# EasyEDA schematic 1-Schematic_testflight2 pcb.json

## Sheets
1 Sheet_1: TITLE: Sheet_1; REV: 1.0; Date: 2022-05-10; Sheet: 1/1; Drawn By: MuchiriIan; Company: Your Company
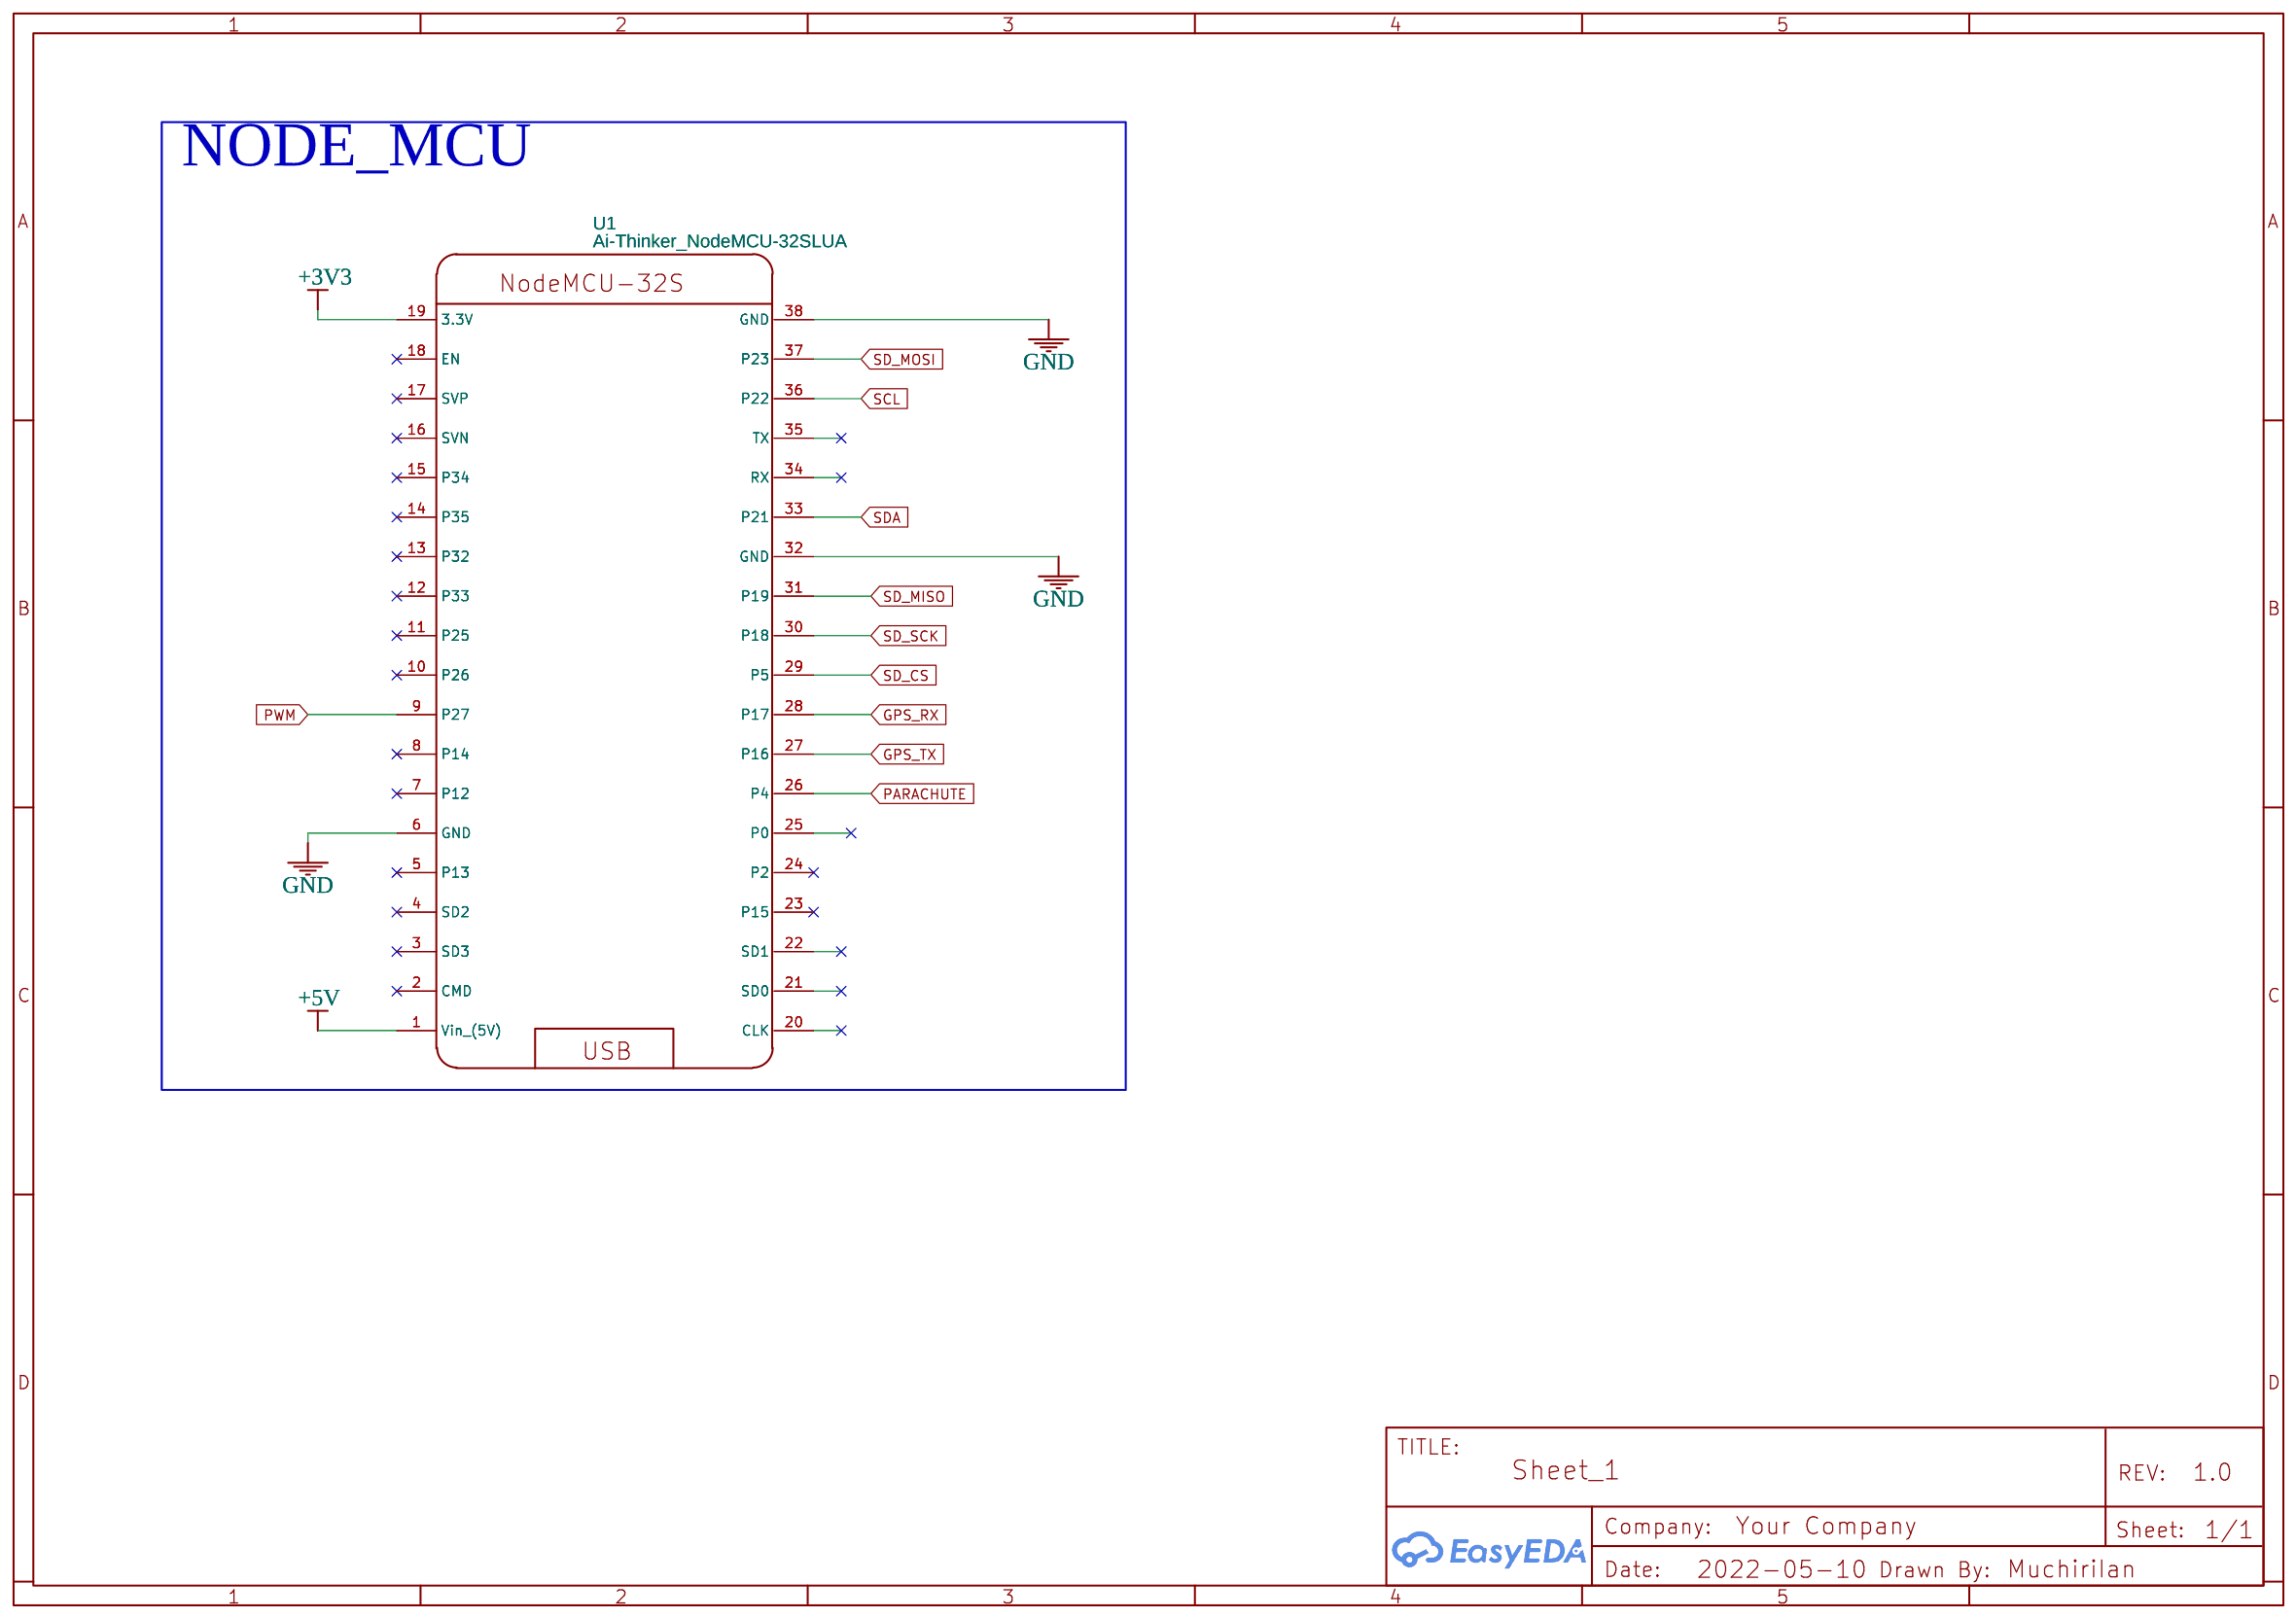
[diagram p0: Sheet_1]
2 Sheet_2: TITLE: Sheet_2
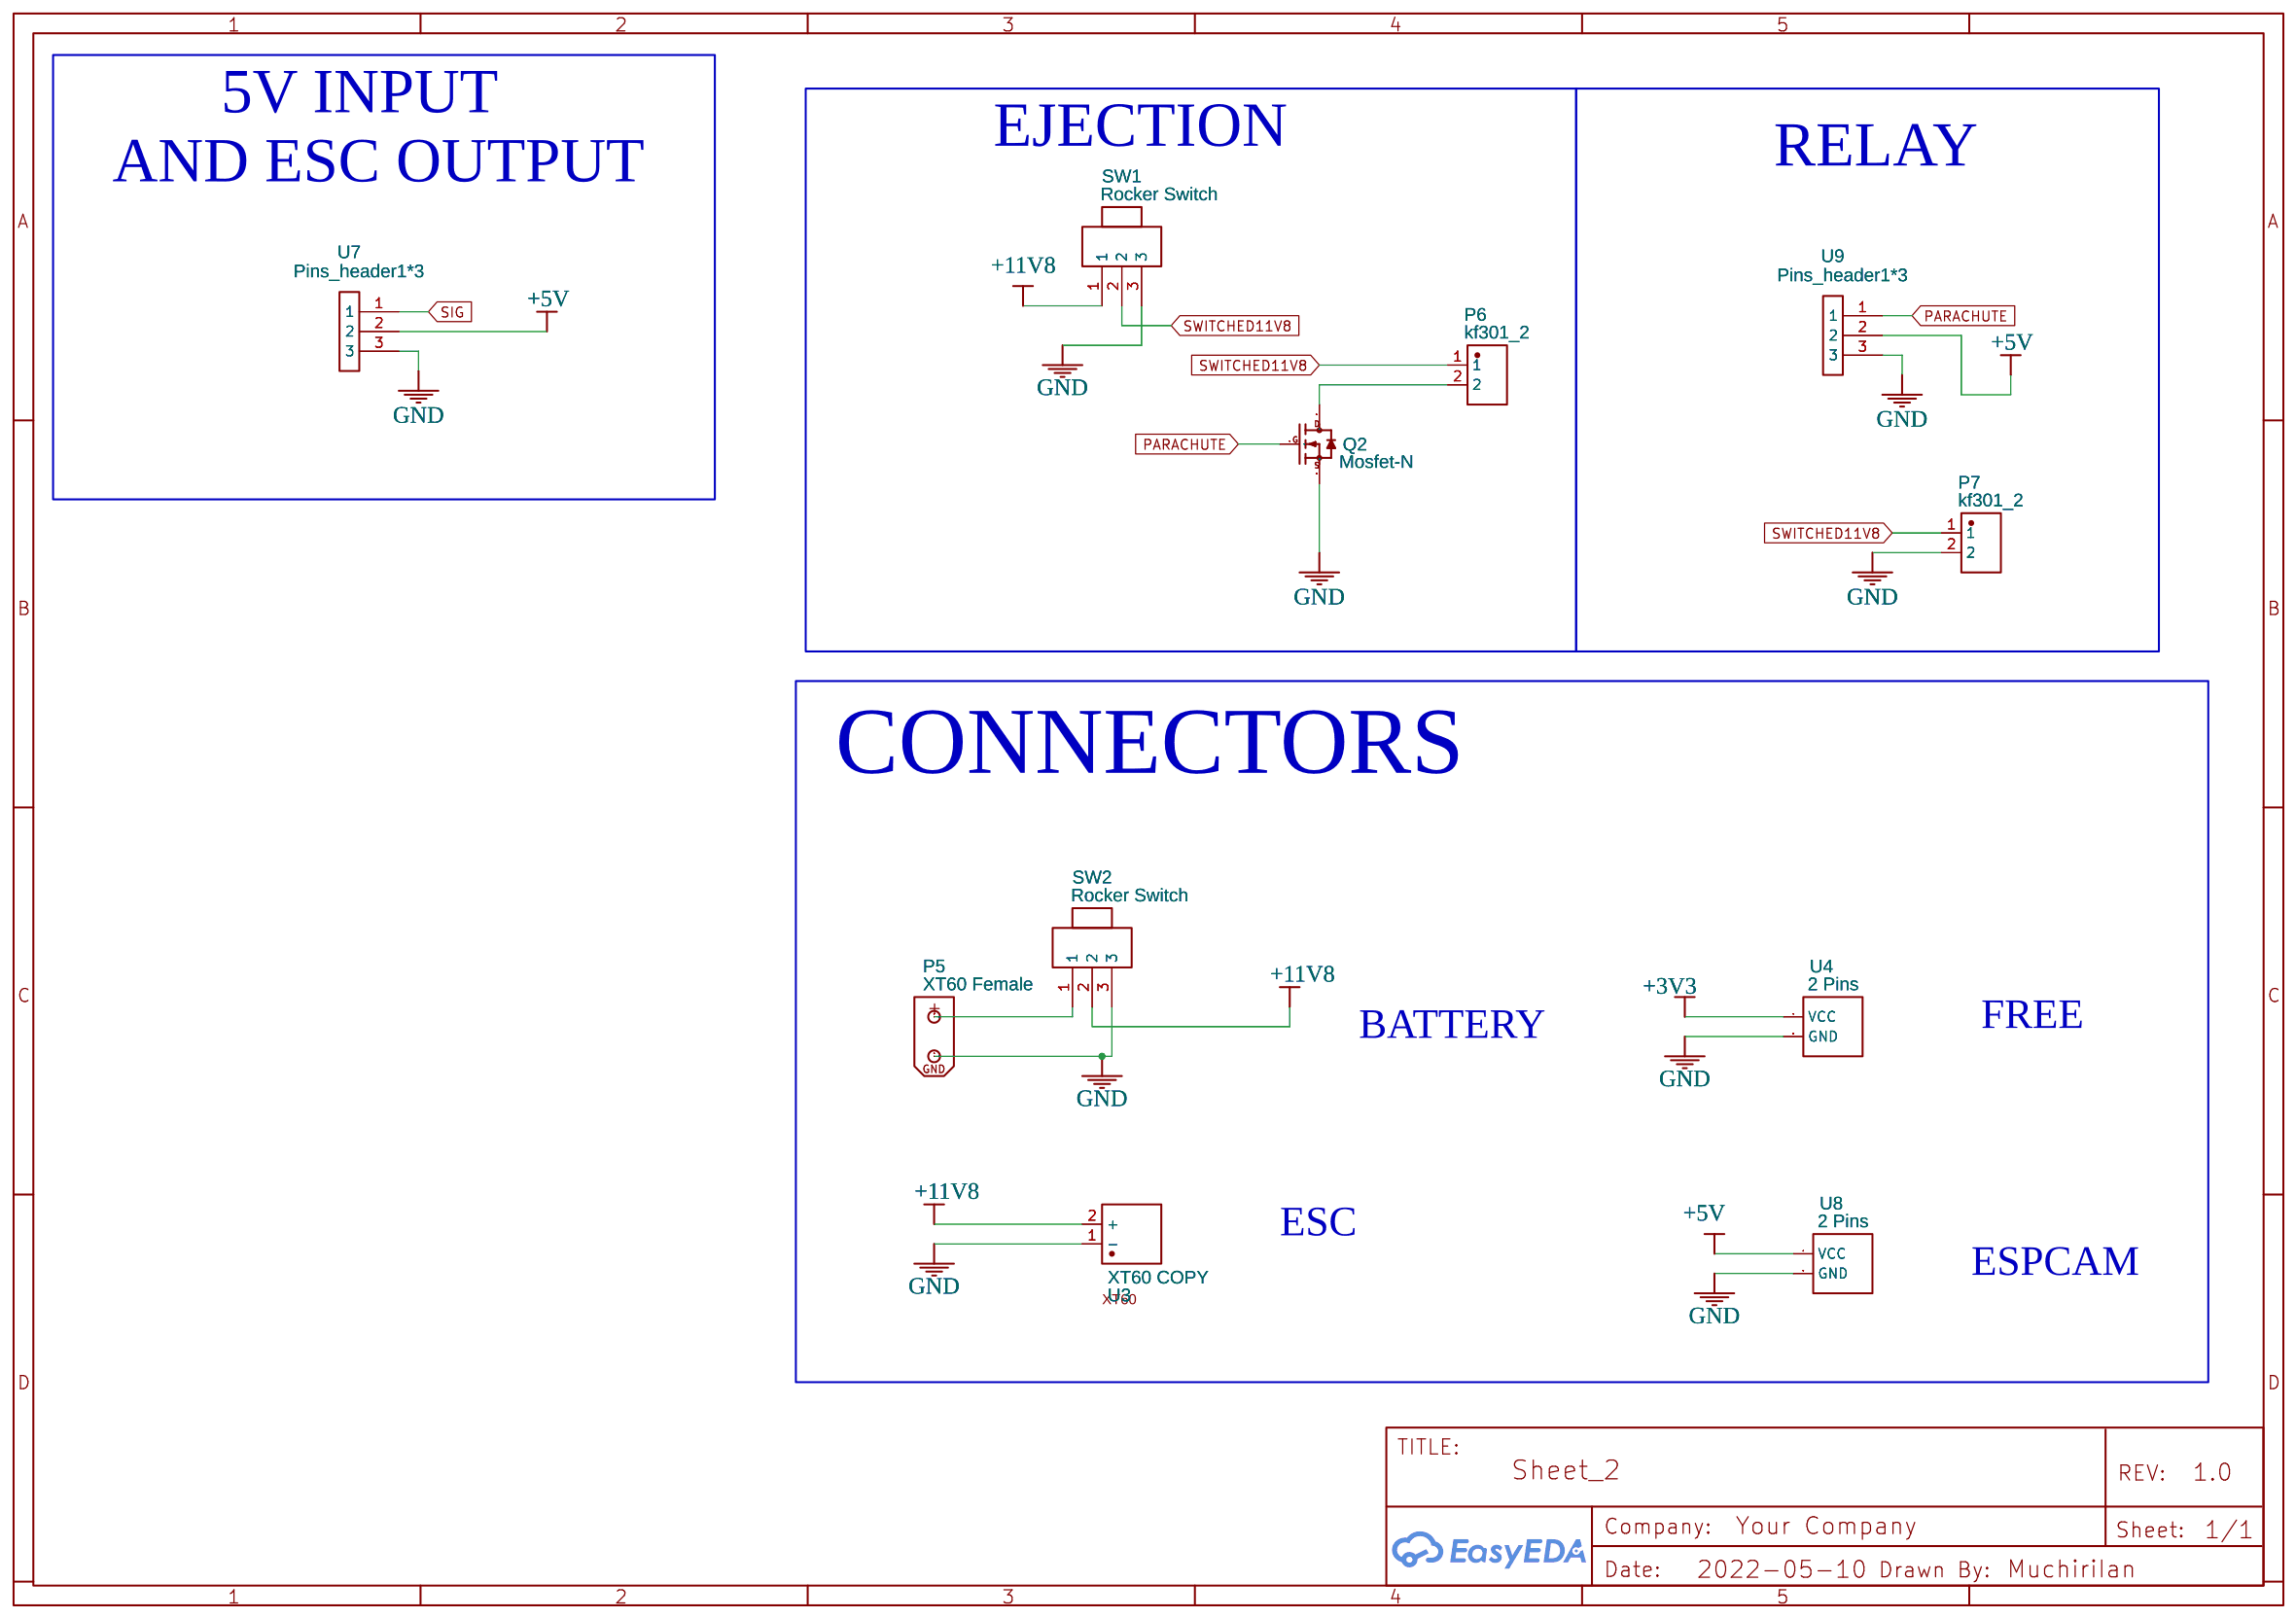
[diagram p1: Sheet_2]
3 Sheet_3: TITLE: Sheet_3
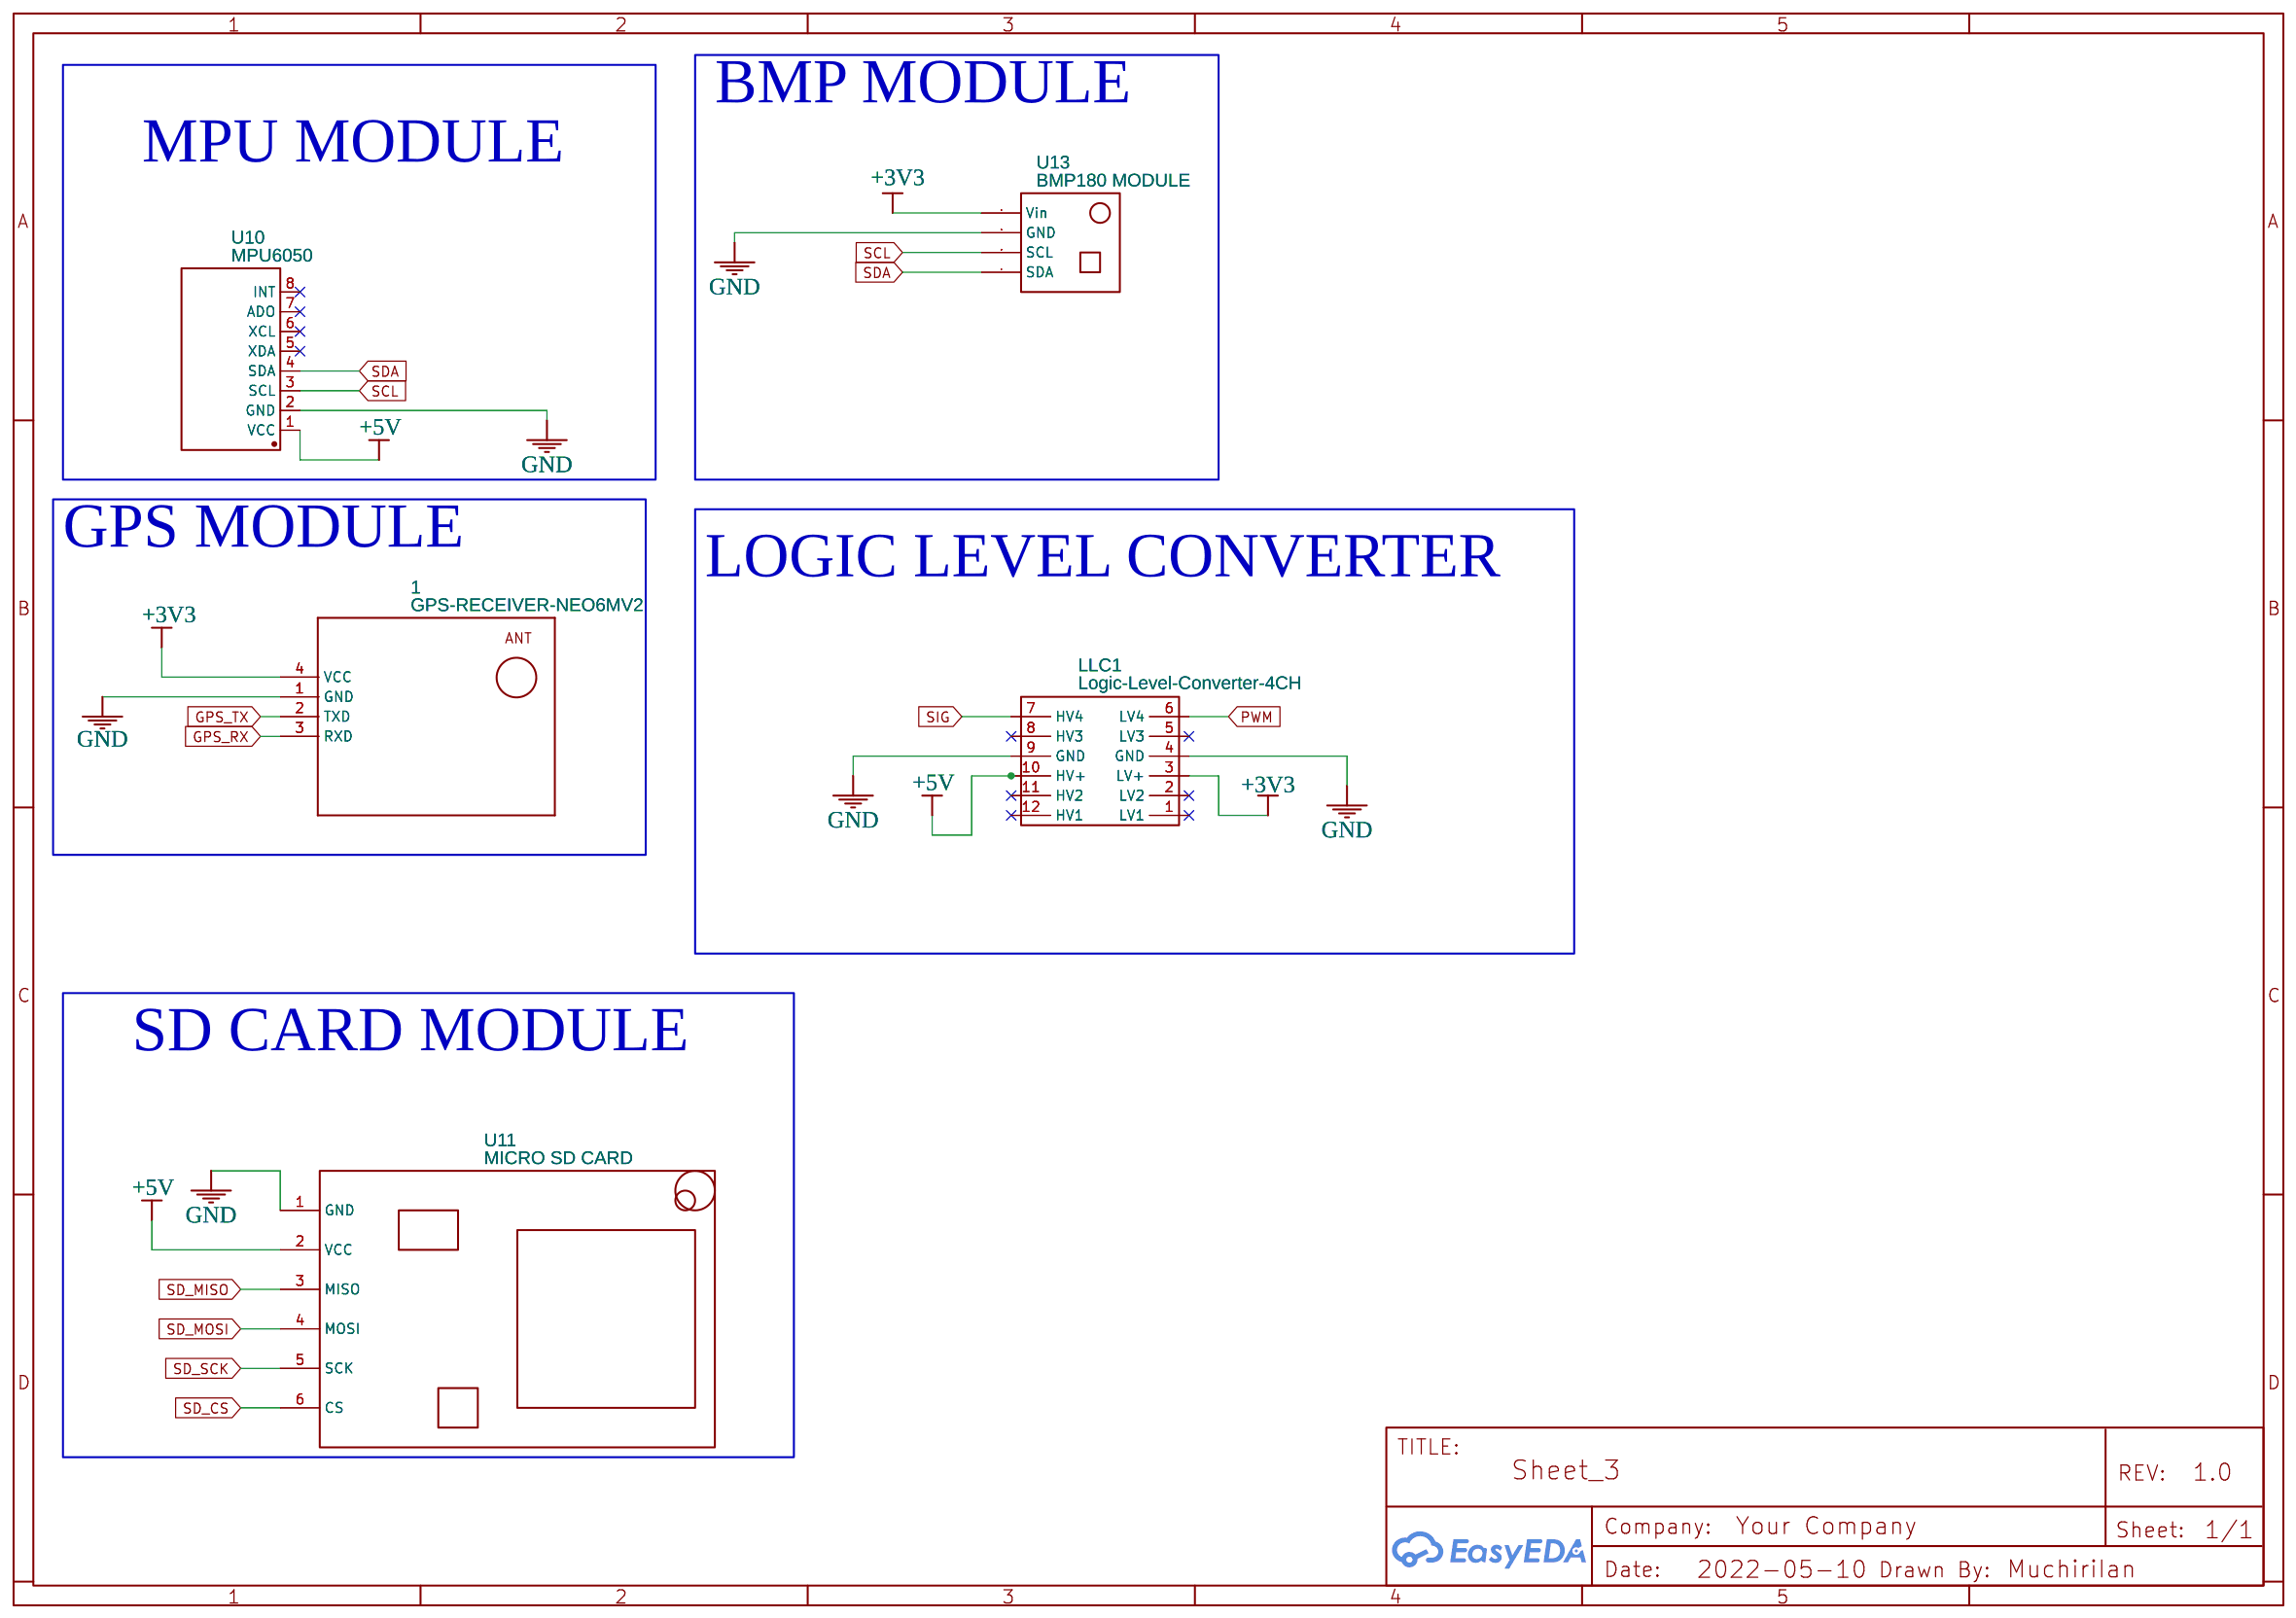
[diagram p2: Sheet_3]

## Parts
sheet Sheet_1
U1  Ai-Thinker_NodeMCU-32SLUA  [AI-THINKER_NODEMCU-32SLUA]
sheet Sheet_2
P5  XT60 Female  [XT60-F]
P6  kf301_2  [KF301_2P]
P7  kf301_2  [KF301_2P]
Q2  Mosfet-N  [DC-MOSFET-TO-220]
SW1  Rocker Switch  [ROCKER SWITCH TH]
SW2  Rocker Switch  [ROCKER SWITCH TH]
U3  XT60 COPY  [XT60]
U4  2 Pins  [2 PINS HEADER]
U7  Pins_header1*3  [PINS_HEADER1*3]
U8  2 Pins  [2 PINS HEADER]
U9  Pins_header1*3  [PINS_HEADER1*3]
sheet Sheet_3
1  GPS-RECEIVER-NEO6MV2  [GPS-RECEIVER-NEO6MV2]
LLC1  Logic-Level-Converter-4CH  [LOGIC-LEVEL-CONVERTER-4CH]
U10  MPU6050  [MPU6050]
U11  MICRO SD CARD  [MICRO SD CARD]
U13  BMP180 MODULE  [BMP180 MODULE (HW-596)]

## Library data of the parts
U1 = Ai-Thinker_NodeMCU-32SLUA: Supplier: LCSC; Supplier Part: C111436; Manufacturer: Ai-Thinker; Manufacturer Part: NodeMCU-32SLua; Contributor: jobsonp checked by LCSC
P5 = XT60 Female: Manufacturer: Changzhou Amass Elec; Contributor: rifanoz
P6 P7 = kf301_2: Manufacturer: BOOMELE; image: //image.lceda.cn/szlcsc/C33435.jpg; Supplier Part: C33435; Contributor: rusrobot
Q2 = Mosfet-N: Contributor: dina
SW1 SW2 = Rocker Switch: Mounted: Yes
U3 = XT60 COPY: Contributor: Mitian
U4 U8 = 2 Pins: Contributor: Uzain Yaseen
U7 U9 = Pins_header1*3: Contributor: Nattanan
1 = GPS-RECEIVER-NEO6MV2: Contributor: lolovo
LLC1 = Logic-Level-Converter-4CH: Supplier Part: 50807; Supplier: Космодром; Contributor: Олег Мошник
U10 = MPU6050: Supplier Part: GY521; Contributor: rahulaggarwal
U11 = MICRO SD CARD: Supplier: RS-Online; Contributor: SRY TIS
U13 = BMP180 MODULE: Manufacturer Part: BMP180 (HW-596); Contributor: esguti

## Nets
+3V3: 1.4(VCC) LLC1.3(LV+) U1.19(3.3V) U4.1(VCC) U13.1(Vin)
+5V: LLC1.10(HV+) U1.1(Vin (5V)) U7.2 U8.1(VCC) U9.2 U10.1(VCC) U11.2(VCC)
+11V8: SW1.1 SW2.2 U3.2(+)
GND: 1.1(GND) LLC1.4(GND) LLC1.9(GND) P5.1 P7.2 Q2.3(S) SW1.3 SW2.3 U1.6(GND) U1.32(GND) U1.38(GND) U3.1(-) U4.2(GND) U7.3 U8.2(GND) U9.3 U10.2(GND) U11.1(GND) U13.2(GND)
GPS_RX: 1.3(RXD) U1.28(P17)
GPS_TX: 1.2(TXD) U1.27(P16)
PARACHUTE: Q2.1(G) U1.26(P4) U9.1
PWM: LLC1.6(LV4) U1.9(P27)
SCL: U1.36(P22) U10.3(SCL) U13.3(SCL)
SD_CS: U1.29(P5) U11.6(CS)
SD_MISO: U1.31(P19) U11.3(MISO)
SD_MOSI: U1.37(P23) U11.4(MOSI)
SD_SCK: U1.30(P18) U11.5(SCK)
SDA: U1.33(P21) U10.4(SDA) U13.4(SDA)
SIG: LLC1.7(HV4) U7.1
SWITCHED11V8: P6.1 P7.1 SW1.2
Net-(P5-2): P5.2 SW2.1
Net-(P6-2): P6.2 Q2.2(D)

Not connected (* = marked no-connect by the designer): LLC1 1(LV1)* 2(LV2)* 5(LV3)* 8(HV3)* 11(HV2)* 12(HV1)*; U1 2(CMD)* 3(SD3)* 4(SD2)* 5(P13)* 7(P12)* 8(P14)* 10(P26)* 11(P25)* 12(P33)* 13(P32)* 14(P35)* 15(P34)* 16(SVN)* 17(SVP)* 18(EN)* 20(CLK) 21(SD0) 22(SD1) 23(P15)* 24(P2)* 25(P0) 34(RX) 35(TX); U10 5(XDA)* 6(XCL)* 7(ADO)* 8(INT)*

## Notes on the sheets
sheet 1
- NODE_MCU
sheet 2
- 5V INPUT
- EJECTION
- RELAY
- AND ESC OUTPUT
- CONNECTORS
- FREE
- BATTERY
- ESC
- ESPCAM
sheet 3
- BMP MODULE
- MPU MODULE
- GPS MODULE
- LOGIC LEVEL CONVERTER
- SD CARD MODULE
